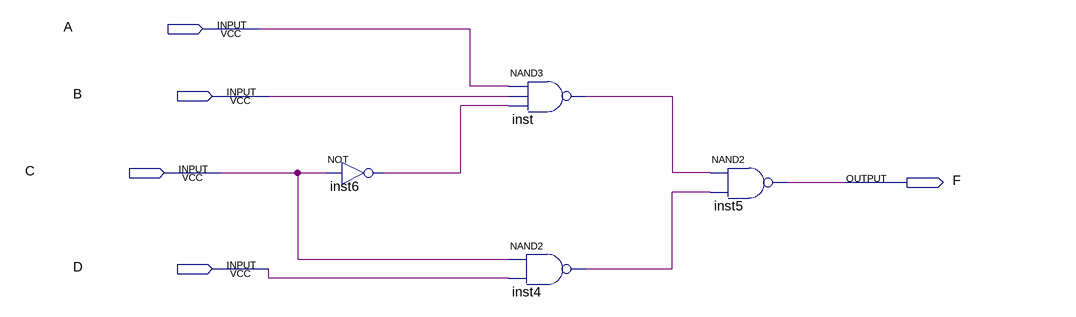
[diagram p0: schematic sheet]
// Quartus schematic risk.bdf as structural Verilog: 4 symbols, 5 pins
module risk (
  input  A,
  input  B,
  input  C,
  input  D,
  output F
);

  wire inst4_out, inst6_out, inst_out;

  not inst6 (inst6_out, C);
  nand inst (inst_out, A, B, inst6_out);
  nand inst4 (inst4_out, C, D);
  nand inst5 (F, inst_out, inst4_out);
endmodule
